# EAGLE design alpha_board_05a (EAGLE 6.6.0)
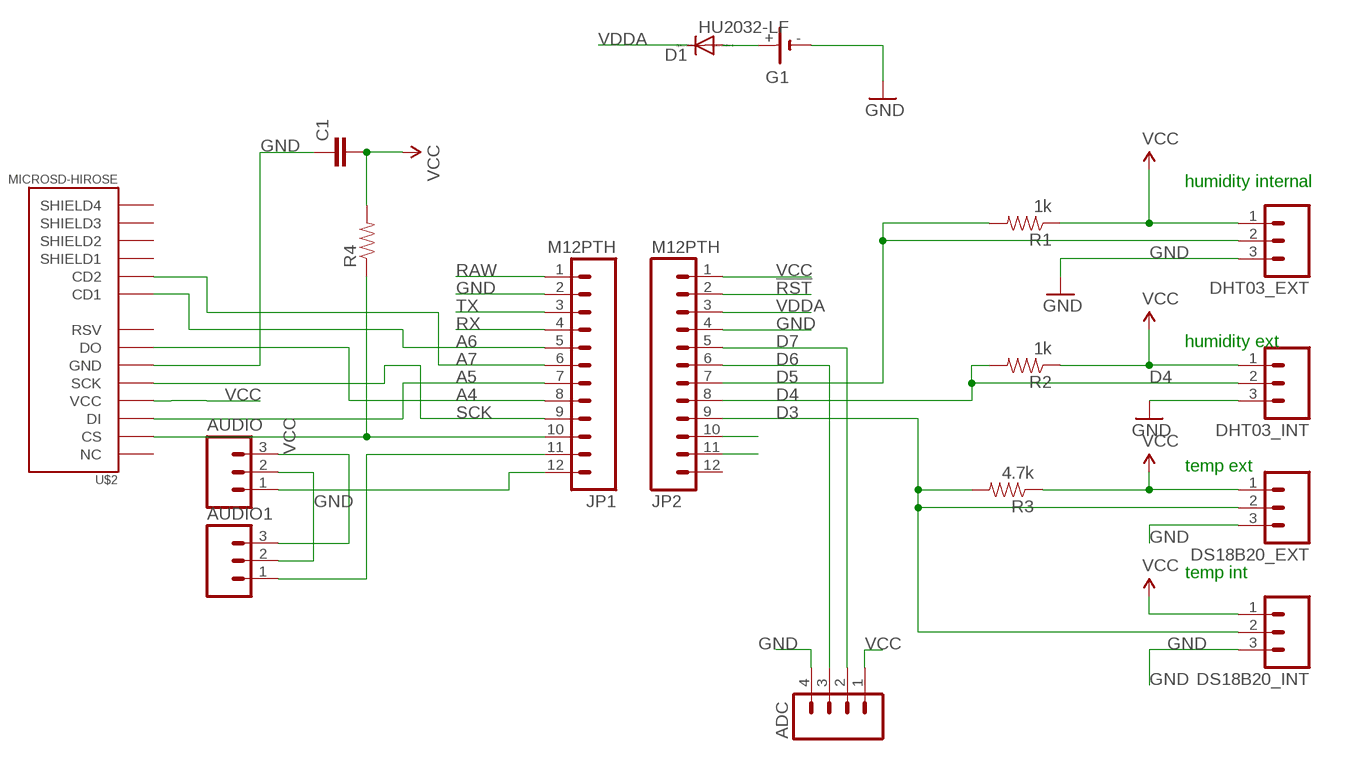
[diagram p0: schematic, sheet 1]

## Parts
ADC  M04LOCK_LONGPADS  [1X04_LOCK_LONGPADS]
AUDIO  M03LOCK  [1X03_LOCK]
AUDIO1  M03LOCK  [1X03_LOCK]
C1  CAP1206  [1206]
D1  DIODE-SOD323-W  [SOD323-W]
DHT03_EXT  M03LOCK  [1X03_LOCK]
DHT03_INT  M03LOCK  [1X03_LOCK]
DS18B20_EXT  M03LOCK  [1X03_LOCK]
DS18B20_INT  M03LOCK  [1X03_LOCK]
G1  HU2032-LF  [HU2032-LF]
JP1  M12PTH  [1X12-SMALL-PADS]
JP2  M12PTH  [1X12-SMALL-PADS]
R1  1k  RESISTOR1206  [1206]
R2  1k  RESISTOR1206  [1206]
R3  4.7k  RESISTOR1206  [1206]
R4  RESISTOR1206  [1206]
U$2  MICROSD-HIROSE  [MICROSD_HOLDER-HIROSE-DM3AT]

## Nets
!RST: JP2.2
A4: JP1.8 U$2.DAT0(DO)
A5: JP1.7 U$2.CMD(DI)
A6: JP1.5 U$2.CD1
A7: JP1.6 U$2.CD2
D3: DS18B20_EXT.2 DS18B20_INT.2 JP2.9 R3.2
D4: DHT03_INT.2 JP2.8 R2.2
D5: DHT03_EXT.2 JP2.7 R1.2
D6: ADC.3 JP2.6
D7: ADC.2 JP2.5
GND: ADC.4 AUDIO1.2 AUDIO.2 C1.1 DHT03_EXT.3 DHT03_INT.3 DS18B20_EXT.3 DS18B20_INT.3 G1.- JP1.2 JP2.4 U$2.VSS(GND)
N$1: JP1.10 R4.1 U$2.DAT3(CS)
N$2: AUDIO.1 JP1.12
N$3: D1.A G1.+
N$4: JP2.11
N$6: AUDIO1.1 JP1.11
N$7: JP2.10
RAW [vcc]: JP1.1
RX: JP1.4
SCK: JP1.9 U$2.CLK(SCK)
TX: JP1.3
VCC: ADC.1 AUDIO1.3 AUDIO.3 C1.2 DHT03_EXT.1 DHT03_INT.1 DS18B20_EXT.1 DS18B20_INT.1 JP2.1 R1.1 R2.1 R3.1 R4.2 U$2.VDD(VCC)
VDDA: D1.C JP2.3
Unconnected: G1.+@1(+) JP2.12 U$2.BODY1(SHIELD1) U$2.BODY2(SHIELD2) U$2.BODY3(SHIELD3) U$2.BODY4(SHIELD4) U$2.DAT1(RSV) U$2.DAT2(NC)

## Notes on the sheet
- humidity internal
- humidity ext
- temp ext
- temp int

## Library data of the parts
ADC = SparkFun-Connectors:M04: Header 4 Standard 4-pin 0.1" header. Use with straight break away headers (SKU : PRT-00116), right angle break away headers (PRT-00553), swiss pins (PRT-00743), machine pins (PRT-00117), and female headers (PRT-00115). Molex polarized connector foot print use with SKU : PRT-08231 with associated crimp pins and housings. 1MM SMD Version SKU: PRT-10208
AUDIO AUDIO1 DHT03_EXT DHT03_INT DS18B20_EXT DS18B20_INT = SparkFun:M03: Header 3 Standard 3-pin 0.1" header. Use with straight break away headers (SKU : PRT-00116), right angle break away headers (PRT-00553), swiss pins (PRT-00743), machine pins (PRT-00117), and female headers (PRT-00115). Molex polarized connector foot print use with SKU : PRT-08232 with associated crimp pins and housings.
C1 = SparkFun:CAP: Capacitor Standard 0603 ceramic capacitor, and 0.1" leaded capacitor.
D1 = diode:DIODE-: DIODE
G1 = Simplex-Battery:HU2032-LF: Renata HU2032 Li battery holder
JP1 JP2 = Spark:M12: Header 12 Standard 12-pin 0.1" header. Use with straight break away headers (SKU : PRT-00116), right angle break away headers (PRT-00553), swiss pins (PRT-00743), machine pins (PRT-00117), and female headers (PRT-00115).
R1-R4 = SparkFun:RESISTOR: Resistor Basic schematic elements and footprints for 0603, 1206, and PTH resistors.
U$2 = calculator_lib:MICROSD-HIROSE

## Board
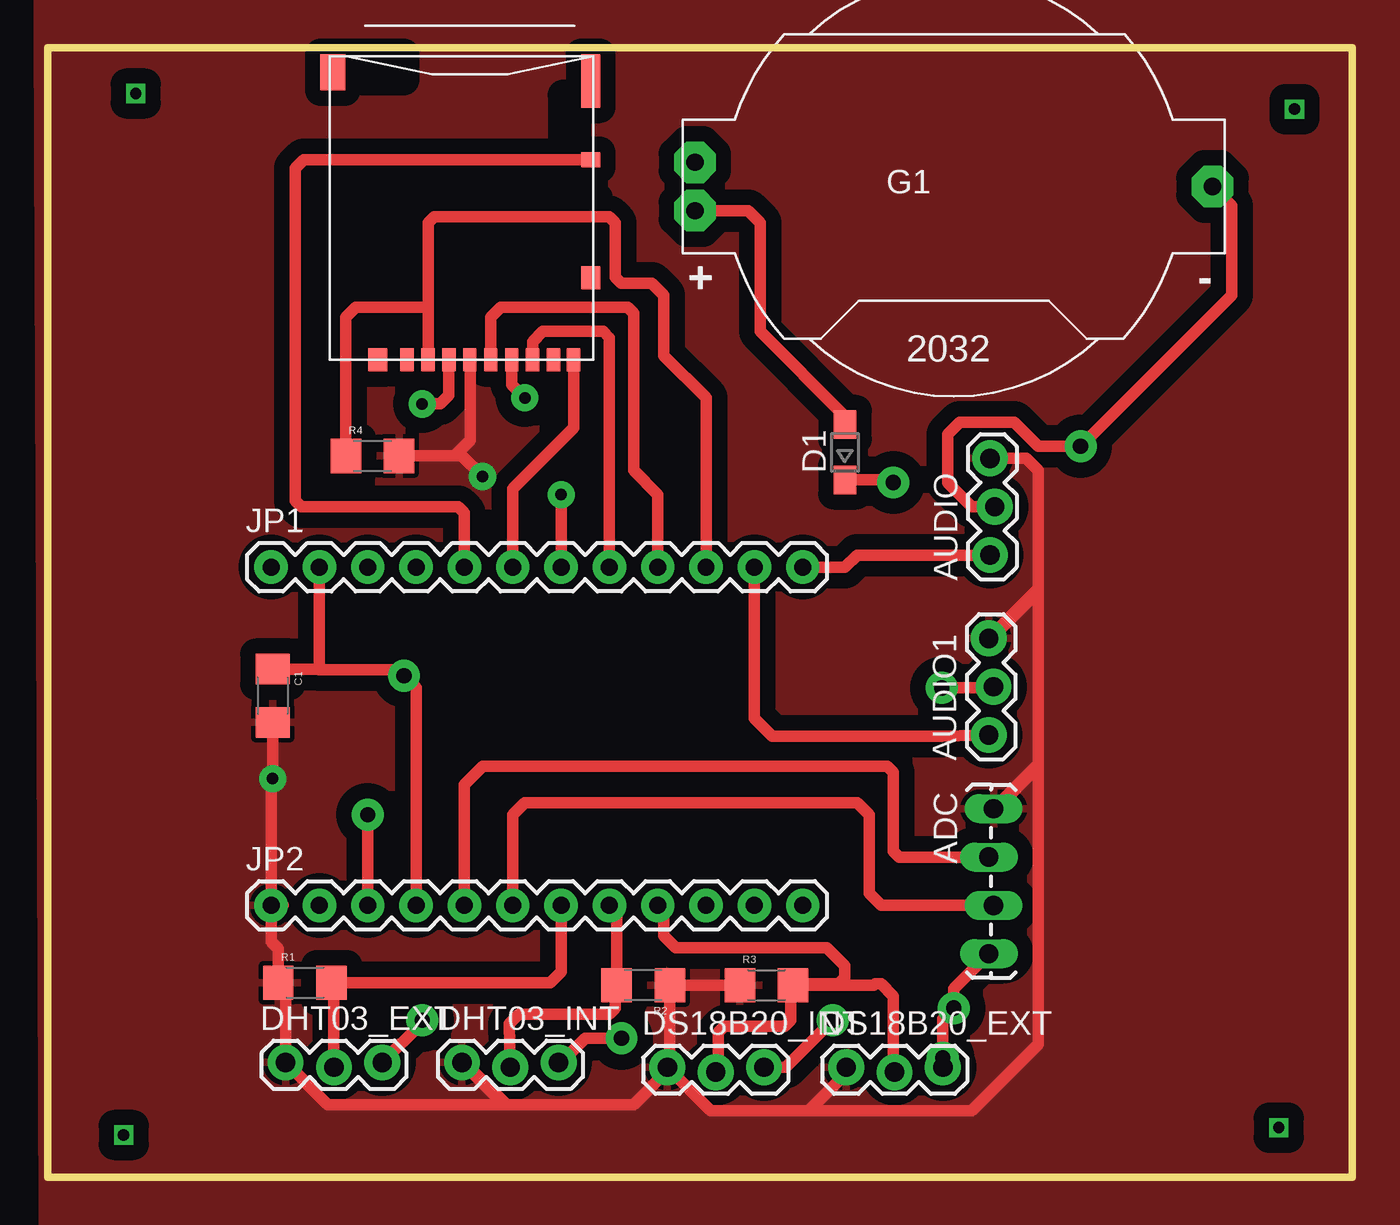
[diagram p1: board, top side]
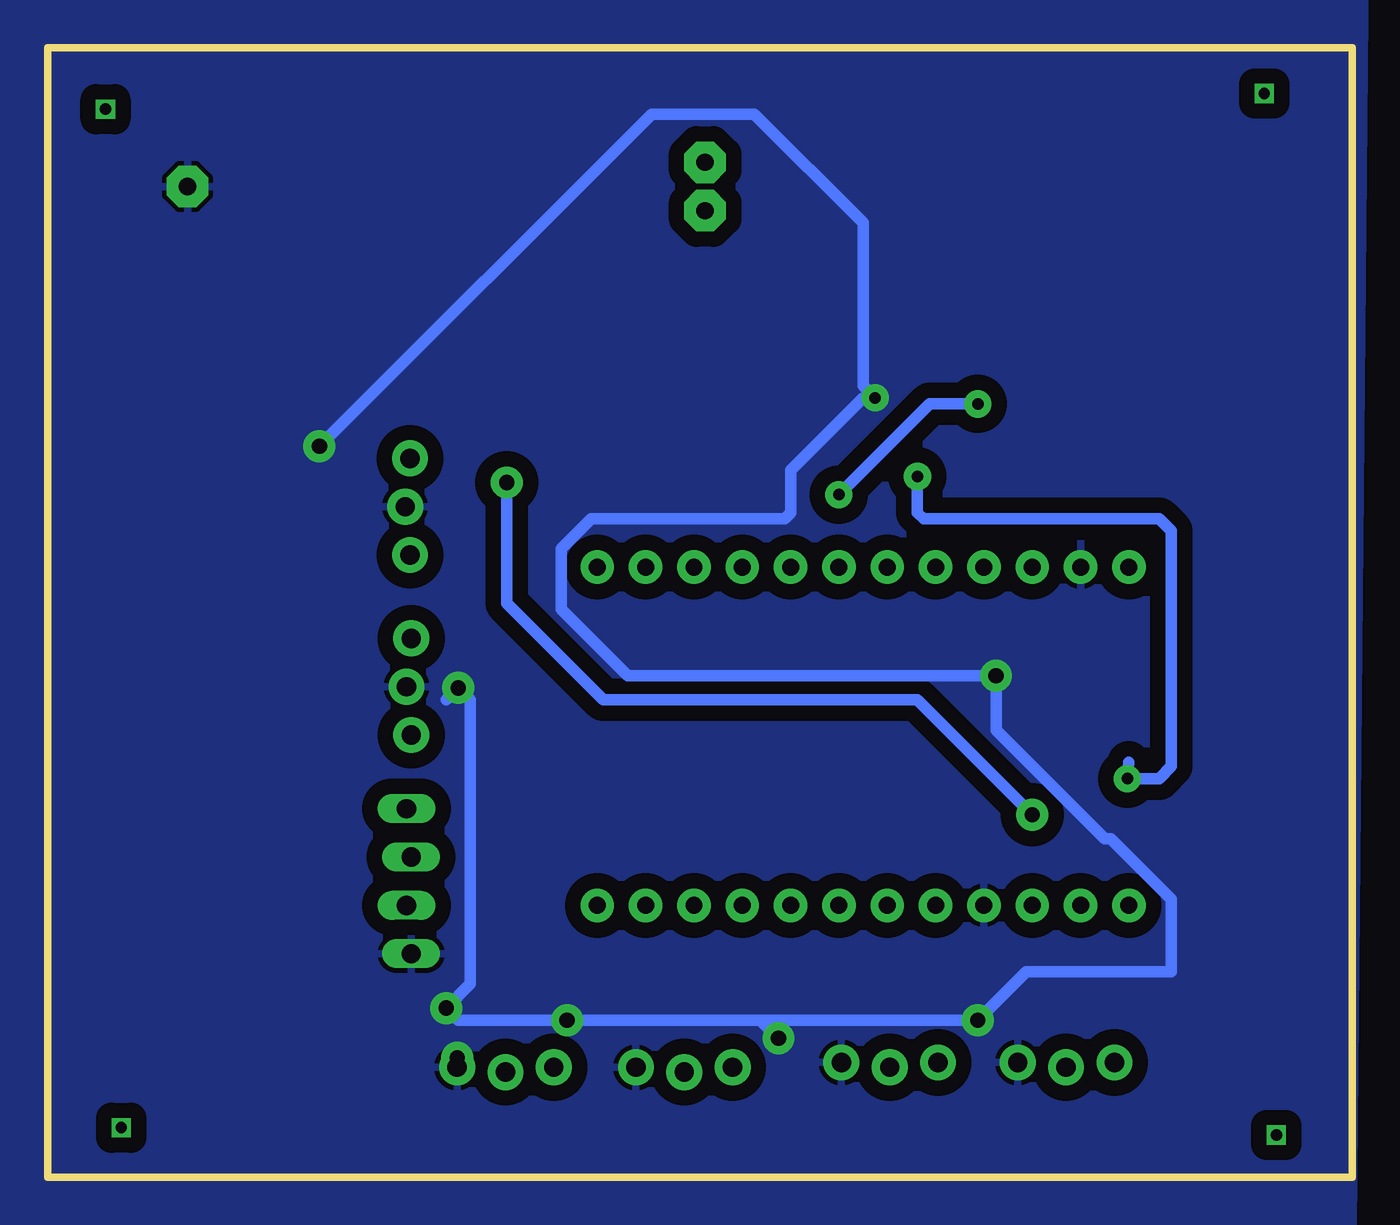
[diagram p2: board, bottom side, seen from below]

Size 68.58 x 59.37 mm. Coordinates in mm from the lower left corner, seen from the top.
Outline: 0,0 0,59.37 68.58,59.37 68.58,0 0,0
Copper layers (1*16): Top 0.035mm / dielectric 1.5mm / Bottom 0.035mm
Design rules "default *": minimum track width 10mil, minimum drill 24mil, track to track 8mil, track to pad 8mil, pad to pad 8mil, via to via 8mil, smd to smd 8mil, copper to edge 0mil, drill to drill 8mil, minimum pad ring 10mil, minimum via ring 8mil, stop-mask expansion 4mil, vias tented up to drill 0mil, thermal gap 10mil

### Footprints (pad centres in the part's own frame; a part is rotated, then mirrored left to right if it is on the bottom)
1X04_LOCK_LONGPADS = drill 1.016 long: 1 0,0; 2 2.54,-0.254; 3 5.08,0; 4 7.62,-0.254
1X03_LOCK = drill 1.016 pad 1.88: 1 0,0.127; 2 2.54,-0.127; 3 5.08,0.127
1206 = smd 1.6 x 1.8: 1 -1.4,0; 2 1.4,0
SOD323-W = smd 1.5 x 1.2: A 1.45,0; C -1.45,0
HU2032-LF = drill 0.9 pad 2.184 octagon: + -13.6,-1.27; +@1 -13.6,1.27; - 13.6,0
1X12-SMALL-PADS = drill 0.889 pad 1.753: 1 0,0; 2 2.54,0; 3 5.08,0; 4 7.62,0; 5 10.16,0; 6 12.7,0; 7 15.24,0; 8 17.78,0; 9 20.32,0; 10 22.86,0; 11 25.4,0; 12 27.94,0
MICROSD_HOLDER-HIROSE-DM3AT = smd 1 x 2.8: BODY1 -6.35,-14.65 | smd 1 x 1.2: BODY2 -6.35,-4.3; BODY4 4.85,0 | smd 1.3 x 1.9: BODY3 7.2,-15.1 | smd 1 x 0.8: CD1 -6.35,-10.5 | smd 0.7 x 1.2: CD2 -5.45,0; CLK -1.1,0; CMD 1.1,0; DAT0 -3.3,0; DAT1 -4.4,0; DAT2 3.3,0; DAT3 2.2,0; VDD 0,0; VSS -2.2,0

### Placement (x,y rotation side)
ADC  49.72,19.37 270 top
AUDIO  49.66,32.7 90 top
AUDIO1  49.59,23.24 90 top
C1  11.83,25.3 270 top
D1  41.91,38.1 90 top
DHT03_EXT  12.51,5.91 0 top
DHT03_INT  21.78,5.91 0 top
DS18B20_EXT  41.97,5.65 0 top
DS18B20_INT  32.58,5.65 0 top
G1  47.62,52.07 0 top
JP1  11.75,32.07 0 top
JP2  11.75,14.29 0 top
R1  13.53,10.22 0 top
R2  31.31,10.1 180 top
R3  37.78,10.1 0 top
R4  17.08,37.91 0 top
U$2  22.19,42.97 180 top

### Tracks (layer width: path | path; a pad name or v marks a point on that pad's centre or on a via)
A4
  Top 0.61: U$2.DAT0 25.49,43.91 26.03,44.45 29.21,44.45 29.53,44.13 JP1.8
A5  (via drill 0.6 pad 1.42)
  Top 0.61: U$2.CMD 21.09,41.1 20.64,40.64 v19.68,40.64 | v26.99,35.88 JP1.7
  Bottom 0.61: v19.68,40.64 22.23,40.64 v26.99,35.88
A6
  Top 0.61: U$2.CD1 13.47,53.47 13.02,53.02 13.02,35.56 13.34,35.24 21.59,35.24 21.91,34.92 JP1.5
A7
  Top 0.61: U$2.CD2 27.64,39.39 24.45,36.2 JP1.6
D3
  Top 0.61: R3.2 39.25,10.16 41.59,10.16 41.91,10.48 41.91,11.11 40.96,12.06 33.02,12.06 32.39,12.7 32.39,13.97 JP2.9 | R3.2 43.43,10.1 43.5,10.16 43.81,10.16 44.45,9.53 44.45,5.59 DS18B20_EXT.2 | DS18B20_INT.2 35.24,5.52 35.24,7.62 35.56,7.94 38.73,7.94 39.05,8.25 39.05,9.97 R3.2
D4
  Top 0.61: R2.2 29.91,10.8 | 29.91,10.8 29.91,13.91 JP2.8 | DHT03_INT.2 24.26,8.06 24.76,8.57 29.53,8.57 29.85,8.89 29.85,10.73 29.91,10.8
D5
  Top 0.61: JP2.7 26.99,10.8 26.42,10.22 R1.2 15.05,10.1 DHT03_EXT.2
D6
  Top 0.61: ADC.3 43.81,14.29 43.18,14.92 43.18,19.05 42.55,19.69 25.08,19.69 24.45,19.05 JP2.6
D7
  Top 0.61: JP2.5 21.91,20.64 22.86,21.59 44.13,21.59 44.45,21.27 44.45,17.15 44.77,16.83 ADC.2
GND  (via drill 0.6 pad 1.42, 0.8 pad 1.68)
  Top 0.61: U$2.VSS 24.39,41.65 v25.08,40.96 | C1.1 14.29,26.7 | 14.29,26.7 JP1.2 14.29,26.67 14.32,26.67 | JP2.4 19.37,25.72 v18.73,26.35 18.42,26.67 14.32,26.67 | 14.32,26.67 14.29,26.7 | G1.- 62.23,51.06 62.23,46.35 v54.29,38.42 52.07,38.42 50.8,39.69 47.94,39.69 47.31,39.05 47.31,36.51 48.58,35.24 AUDIO.2 | v19.68,8.25 19.68,8.13 DHT03_EXT.3 | DS18B20_INT.3 38.8,5.78 v41.27,8.25 | v30.16,7.3 28.26,7.3 26.99,6.03 | v46.99,25.72 49.66,25.72 AUDIO1.2 | ADC.4 47.62,9.91 v47.62,8.89 47.05,8.32 v47.05,6.29
  Bottom 0.61: 47.56,6.29 DS18B20_EXT.3 v47.05,6.29 | v18.73,26.35 19.05,26.35 | v54.29,38.42 36.83,55.88 31.43,55.88 25.72,50.17 25.72,41.59 v25.08,40.96 25.72,40.96 29.53,37.15 29.53,34.92 29.85,34.61 40.01,34.61 41.59,33.02 41.59,29.85 38.1,26.35 19.05,26.35 | 19.05,26.35 18.73,26.67 18.73,23.49 13.02,17.78 12.7,17.78 9.53,14.6 9.53,10.8 17.15,10.8 v19.68,8.25 31.12,8.25 | 31.12,8.25 v41.27,8.25 46.99,8.25 v47.62,8.89 46.36,10.16 46.36,25.08 v46.99,25.72 47.62,25.08 | 31.12,8.25 v30.16,7.3
  pour Bottom (isolate 0.813): -0.7,66.68 84.96,66.61 85.6,-8.51 0,-8.19
N$1
  Top 0.61: JP1.10 34.61,40.96 32.39,43.18 32.39,46.35 31.75,46.99 30.16,46.99 29.85,47.31 29.85,50.17 29.53,50.48 20.32,50.48 20,50.17 20,45.72 | U$2.DAT3 20,42.98 20,45.72 | 20,45.72 16.19,45.72 15.68,45.21 R4.1
N$2
  Top 0.61: JP1.12 41.91,32.07 42.55,32.7 AUDIO.1
N$3
  Top 0.61: D1.A 41.91,40 37.47,44.45 37.47,50.17 36.83,50.8 G1.+
N$6
  Top 0.61: JP1.11 37.15,24.13 38.1,23.18 46.36,23.18 | 46.99,23.18 46.36,23.18 | 46.36,23.18 AUDIO1.1
N$14  (via drill 0.6)
  other vias: 4.64,56.96
N$15  (via drill 0.6)
  other vias: 65.53,56.13
N$16  (via drill 0.6)
  other vias: 64.71,2.6
N$17  (via drill 0.6)
  other vias: 4,2.22
SCK
  Top 0.61: U$2.CLK 23.29,45.2 23.81,45.72 30.48,45.72 30.8,45.4 30.8,37.15 32.07,35.88 JP1.9
VCC  (via drill 0.6 pad 1.42)
  Top 0.61: U$2.VDD 22.23,42.94 22.23,38.74 21.4,37.91 R4.2 21.78,37.91 v22.86,36.83 | C1.2 v11.83,20.96 | v11.83,20.96 11.83,20.72 | R3.1 R2.1 32.71,5.91 DS18B20_INT.1 | v11.83,20.96 11.75,20.87 JP2.1 12.38,14.29 11.75,13.65 11.75,12.38 12.13,12 R1.1 12.51,9.84 DHT03_EXT.1 14.73,3.81 24,3.81 | AUDIO.3 51.44,37.78 52.07,37.15 52.07,30.92 AUDIO1.3 49.59,28.32 52.07,30.8 52.07,21.72 ADC.1 49.85,19.37 52.07,21.59 52.07,6.98 48.58,3.49 40.01,3.49 | DS18B20_EXT.1 41.97,5.46 40.01,3.49 | 40.01,3.49 34.86,3.49 DS18B20_INT.1 | DS18B20_INT.1 32.58,5.59 30.8,3.81 24.13,3.81 | 24.13,3.81 24,3.81 | 24,3.81 DHT03_INT.1 21.91,6.03 24.13,3.81
  Bottom 0.61: v22.86,36.83 22.86,34.92 22.54,34.61 10.16,34.61 9.53,33.97 9.53,21.59 10.16,20.96 v11.83,20.96 11.75,21.82
  pour Top (isolate 0.813): -0.57,66.61 84.84,65.98 84.96,-8.51 -0.25,-8.19
VDDA  (via drill 0.8 pad 1.68)
  Top 0.61: D1.C 44.31,36.65 v44.45,36.51 | v16.83,19.05 JP2.3
  Bottom 0.61: v44.45,36.51 44.45,30.16 39.37,25.08 22.86,25.08 v16.83,19.05